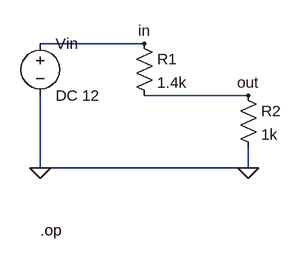
[diagram p0: schematic voltage_divider.asc]
voltage_divider.asc, the LTspice schematic file:
Version 4
SHEET 1 880 680
WIRE 80 160 240 160
WIRE 240 240 400 240
WIRE 80 240 80 352
WIRE 400 320 400 352
WIRE 80 352 400 352
FLAG 80 352 0
FLAG 400 352 0
FLAG 240 160 in
FLAG 400 240 out
SYMBOL voltage 80 144 R0
SYMATTR InstName Vin
SYMATTR Value DC 12
SYMBOL res 224 144 R0
SYMATTR InstName R1
SYMATTR Value 1.4k
SYMBOL res 384 224 R0
SYMATTR InstName R2
SYMATTR Value 1k
TEXT 80 448 Left 2 !.op
* End of ltspice-ai-agent output

The netlist it stands for:
* voltage_divider.asc
Vin in 0 DC 12
R1 in out 1.4k
R2 out 0 1k
.op
.backanno
.end